# Altium schematic sheet MCU.SchDoc
size A4; SheetNumber: 3; SheetTotal: 5
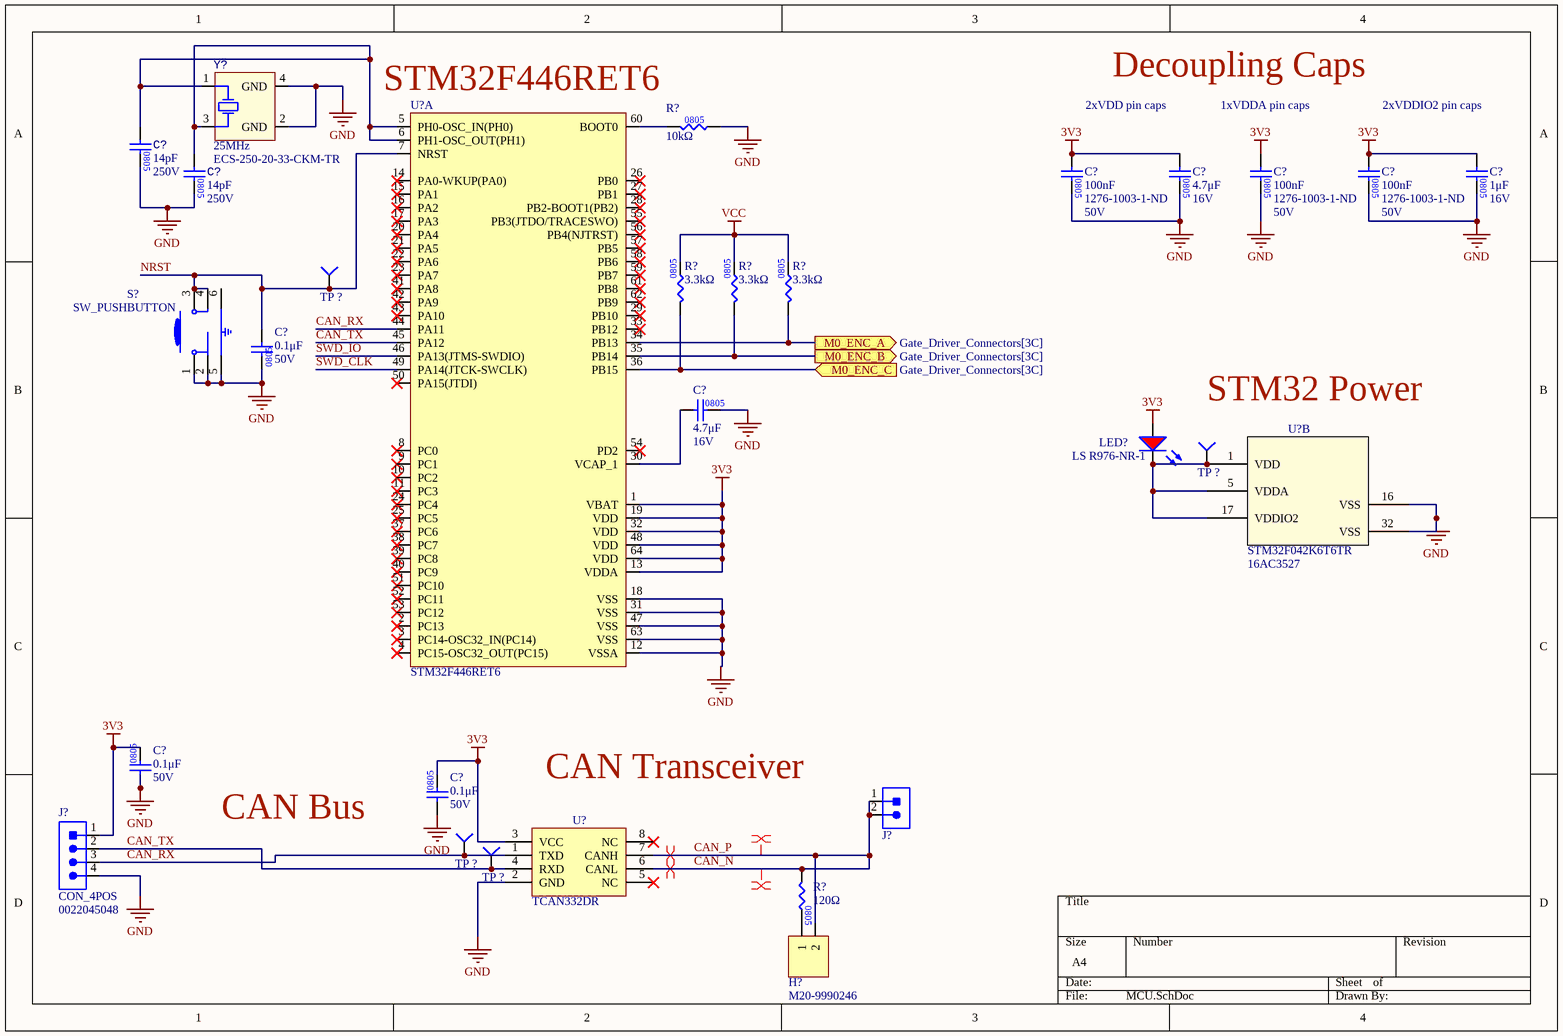
[diagram p0: MCU.SchDoc]

## Parts
(Parts that share a designator on the sheet are numbered #1, #2 ... from top to bottom, then left to right.)
C?#1  value 14pF  Voltage Rating: 250V  [CAP0805]  (hidden comment: CAP_14pF_50V_0805)
C?#2  value 14pF  Voltage Rating: 250V  [CAP0805]  (hidden comment: CAP_14pF_50V_0805)
C?#3  value 100nF  Supplier Part Number 1: 1276-1003-1-ND  Voltage Rating: 50V  [CAP0805]  (hidden comment: CAP_100nF_50V_0805)
C?#4  value 4.7μF  Voltage Rating: 16V  [CAP0805]  (hidden comment: CAP_4.7uF_16V_0805)
C?#5  value 100nF  Supplier Part Number 1: 1276-1003-1-ND  Voltage Rating: 50V  [CAP0805]  (hidden comment: CAP_100nF_50V_0805)
C?#6  value 100nF  Supplier Part Number 1: 1276-1003-1-ND  Voltage Rating: 50V  [CAP0805]  (hidden comment: CAP_100nF_50V_0805)
C?#7  value 1μF  Voltage Rating: 16V  [CAP0805]  (hidden comment: CAP_1uF_16V_0805)
C?#8  value 0.1μF  Voltage Rating: 50V  [CAP2012]  (hidden comment: CAP_0.1uF_50V_0805)
C?#9  value 4.7μF  Voltage Rating: 16V  [CAP0805]  (hidden comment: CAP_4.7uF_16V_0805)
C?#10  value 0.1μF  Voltage Rating: 50V  [CAP0805]  (hidden comment: CAP_0.1uF_50V_0805)
C?#11  value 0.1μF  Voltage Rating: 50V  [CAP0805]  (hidden comment: CAP_0.1uF_50V_0805)
H?  Manufacturer Part Number 1: M20-9990246  [HDR1X2]  (hidden comment: HEADER)
J?#1  CON_2POS_SCREW_TERM  [1935161]  (value not drawn)
J?#2  CON_4POS  Manufacturer Part Number: 0022045048
LED?  Manufacturer Part Number 1: LS R976-NR-1  [LED_0805_RED]  (hidden comment: LED_RED)
R?#1  value 10kΩ  [RES0805]  (hidden comment: RES_10kΩ_0805_5%)
R?#2  value 3.3kΩ  [RES0805]  (hidden comment: RES_3.3kΩ_0805_1%)
R?#3  value 3.3kΩ  [RES0805]  (hidden comment: RES_3.3kΩ_0805_1%)
R?#4  value 3.3kΩ  [RES0805]  (hidden comment: RES_3.3kΩ_0805_1%)
R?#5  value 120Ω  [RES0805]  (hidden comment: RES_120Ω_0805_1%)
S?  SW_PUSHBUTTON  [TACTILE_SWITCH_SMD]
TP_?#1  TESTPOINT_1MM_CIRCLE  [TESTPOINT_CIRCLE_1MM]  (value not drawn)  (no BOM)
TP_?#2  TESTPOINT_1MM_CIRCLE  [TESTPOINT_CIRCLE_1MM]  (value not drawn)  (no BOM)
TP_?#3  TESTPOINT_1MM_CIRCLE  [TESTPOINT_CIRCLE_1MM]  (value not drawn)  (no BOM)
TP_?#4  TESTPOINT_1MM_CIRCLE  [TESTPOINT_CIRCLE_1MM]  (value not drawn)  (no BOM)
U?#1  STM32F446RET6  [STM_LQFP64_N]  (part A of 3)
U?#2  STM32F042K6T6TR  Supplier Part Number 1: 16AC3527  [LQFP-32]  (part B of 2)
U?#3  TCAN332DR  [SOIC127P599X175-8N]
Y?  Frequency: 25MHz  Manufacturer Part Number 1: ECS-250-20-33-CKM-TR  [XTAL_ECS-250-20-33-CKM-TR]  (hidden comment: CRYSTAL_25MHZ_20PF)

## Ports
M0_ENC_A (out, see Gate_Driver_Connectors[3C]), M0_ENC_B (out, see Gate_Driver_Connectors[3C]), M0_ENC_C (in, see Gate_Driver_Connectors[3C])

## Nets
3V3: C?#3.1 C?#4.1 C?#5.1 C?#6.1 C?#7.1 C?#10.2 C?#11.2 J?#2.1 LED?.1(A) U?#1.1(VBAT) U?#1.13(VDDA) U?#1.19(VDD) U?#1.32(VDD) U?#1.48(VDD) U?#1.64(VDD) U?#3.3(VCC)
GND: C?#1.2 C?#2.2 C?#3.2 C?#4.2 C?#5.2 C?#6.2 C?#7.2 C?#8.1 C?#9.2 C?#10.1 C?#11.1 J?#2.4 R?#1.1 S?.1 S?.2 S?.5 U?#1.12(VSSA) U?#1.18(VSS) U?#1.31(VSS) U?#1.47(VSS) U?#1.63(VSS) U?#2.16(VSS) U?#2.32(VSS) U?#3.2(GND) Y?.2(GND) Y?.4(GND)
VCC: R?#2.2 R?#3.2 R?#4.2
CAN_N: H?.2 J?#1.1 J?#1.2 R?#5.1 U?#3.6(CANL) U?#3.7(CANH)  [also labelled CAN_P]
CAN_RX: J?#2.3 TP_?#3.1(=value) U?#1.44(PA11) U?#3.1(TXD)
CAN_TX: J?#2.2 TP_?#4.1(=value) U?#1.45(PA12) U?#3.4(RXD)
M0_ENC_A: R?#4.1 U?#1.34(PB13) ; port M0_ENC_A
M0_ENC_B: R?#3.1 U?#1.35(PB14) ; port M0_ENC_B
M0_ENC_C: R?#2.1 U?#1.36(PB15) ; port M0_ENC_C
NRST: C?#8.2 S?.3 S?.4 TP_?#1.1(=value) U?#1.7(NRST)
SWD_CLK: U?#1.49(PA14(JTCK-SWCLK))
SWD_IO: U?#1.46(PA13(JTMS-SWDIO))
NetC?#1_1: C?#1.1 C?#2.1 U?#1.5(PH0-OSC_IN(PH0)) U?#1.6(PH1-OSC_OUT(PH1)) Y?.1(HOT) Y?.3(HOT)
NetC?#9_1: C?#9.1 U?#1.30(VCAP_1)
NetH?_1: H?.1 R?#5.2
NetLED?_2: LED?.2(K) TP_?#2.1(=value) U?#2.1(VDD) U?#2.5(VDDA) U?#2.17(VDDIO2)
NetR?#1_2: R?#1.2 U?#1.60(BOOT0)

Not connected (* = marked no-connect by the designer): S? 6; U?#1 2(PC13)* 3(PC14-OSC32_IN(PC14))* 4(PC15-OSC32_OUT(PC15))* 8(PC0)* 9(PC1)* 10(PC2)* 11(PC3)* 14(PA0-WKUP(PA0))* 15(PA1)* 16(PA2)* 17(PA3)* 20(PA4)* 21(PA5)* 22(PA6)* 23(PA7)* 24(PC4)* 25(PC5)* 26(PB0)* 27(PB1)* 28(PB2-BOOT1(PB2))* 29(PB10)* 33(PB12)* 37(PC6)* 38(PC7)* 39(PC8)* 40(PC9)* 41(PA8)* 42(PA9)* 43(PA10)* 50(PA15(JTDI))* 51(PC10)* 52(PC11)* 53(PC12)* 54(PD2)* 55(PB3(JTDO/TRACESWO))* 56(PB4(NJTRST))* 57(PB5)* 58(PB6)* 59(PB7)* 61(PB8)* 62(PB9)*; U?#3 5(NC)* 8(NC)*

## Layout directives
differential pair: CAN_N

## Notes on the sheet
- (near U?#1) STM32F446RET6
- 2xVDD pin caps
- Decoupling Caps
- 1xVDDA pin caps
- 2xVDDIO2 pin caps
- STM32 Power
- CAN Transceiver
- CAN Bus

## Library data of the parts
C?#1 C?#2 = CAP_14pF_50V_0805: CERAMIC CAP MLCC HIGH-Q 125C; Manufacturer: Murata Electronics; Manufacturer Part Number: GQM2195C2E140JB12D; Mounting Type: SMD; Package: 0805; Supplier 1: Digi-Key; Supplier Part Number 1: 490-GQM2195C2E140JB12DCT-ND
C?#3 C?#5 C?#6 = CAP_100nF_50V_0805: CAP CER 0.1UF 50V X7R 0805; Manufacturer 1: Samsung Electro-Mechanics; Manufacturer Part Number 1: CL21B104KBCNNNC; Package/Footprint: 0805; Supplier 1: Digi-Key
C?#4 = CAP_4.7uF_16V_0805: CAP CER 4.7UF 16V X5R 0805; Manufacturer 1: Samsung Electro-Mechanics; Manufacturer Part Number 1: CL21A475KOFNNNE; Mounting Type: SMD; Supplier 1: Digi-Key; Supplier Part Number 1: 1276-1065-1-ND; Package: 0805; LCSC Part #: C1779; Dielectric: X5R
C?#7 = CAP_1uF_16V_0805: CAP CER 1UF 16V X7R 0805; Manufacturer 1: Yageo; Manufacturer Part Number 1: CC0805KKX7R7BB105; Mounting Type: SMD; Supplier 1: Digi-Key; Supplier Part Number 1: 311-1365-1-ND; Package: 0805; Dielectric: X7R
C?#8 = CAP_0.1uF_50V_0805: CAP CER 0.1UF 50V X7R 0805; Manufacturer Part Number 1: GCM21BR71H104KA37K; Manufacturer 1: Murata Electronics; Package/Footprint: 0805; Supplier Part Number 1: 490-8049-1-ND; Supplier 1: Digi-Key; Dielectric: X7R; LCSC Part #: C49678; Mounting Type: SMD
C?#9 = CAP_4.7uF_16V_0805: CAP CER 4.7UF 16V X5R 0805; Manufacturer Part Number 1: CL21A475KOFNNNE; Manufacturer 1: Samsung Electro-Mechanics; Supplier Part Number 1: 1276-1065-1-ND; Supplier 1: Digi-Key; Dielectric: X5R; LCSC Part #: C1779; Mounting Type: SMD; Package: 0805
C?#10 C?#11 = CAP_0.1uF_50V_0805: CAP CER 0.1UF 50V X7R 0805; Manufacturer 1: Murata Electronics; Manufacturer Part Number 1: GCM21BR71H104KA37K; Package/Footprint: 0805; Mounting Type: SMD; Supplier 1: Digi-Key; Supplier Part Number 1: 490-8049-1-ND; Dielectric: X7R; LCSC Part #: C49678
H? = HEADER: HEADER 2X1; Manufacturer 1: Harwin Inc.; Package/Footprint: TH; Mounting Type: TH; Supplier 1: Digi-Key; Supplier Part Number 1: 952-2262-ND
J?#1 = CON_2POS_SCREW_TERM: TERM BLK 2POS SIDE ENTRY 5MM; Manufacturer 1: Phoenix Contact; Package/Footprint: SMD; Supplier 1: Digi-Key; Mounting Type: TH; Supplier Part Number 1: 277-1667-ND; Manufacturer Part Number 1: 1935161
J?#2 = CON_4POS: CONN HEADER VERT 4POS 2.54MM; Manufacturer: Molex; Supplier 1: Digi-Key; Supplier Part Number 1: 0022045048-ND; RoHS: Yes; Category: Headers and Wire Housings; Pricing 1: 16000=0.12858 (USD); ComponentLink1URL: https://datasheet.ciiva.com/6839/022045032-sd-6839882.pdf?src-supplier=Digi-Key; ComponentLink1Description: https://datasheet.ciiva.com/6839/022045032-sd-6839882.pdf?src-supplier=Digi-Key
LED? = LED_RED: LED RED DIFFUSED 0805 SMD; Manufacturer 1: OSRAM; Package/Footprint: 0805; Forward Voltage Drop: 2V; Forward Current: 20mA; Supplier Part Number 1: 475-1278-1-ND; Supplier 1: Digi-Key; Mounting Type: SMD
R?#1 = RES_10kΩ_0805_5%: RES 10K OHM 5% 1/8W 0805; Manufacturer 1: Panasonic Electronic Components; Manufacturer Part Number 1: ERJ-6GEYJ103V; Package/Footprint: 0805; Supplier Part Number 1: P10KACT-ND; Supplier 1: Digi-Key; LCSC Part #: C17414; Mounting Type: SMD
R?#2-R?#4 = RES_3.3kΩ_0805_1%: RES 3.3K OHM 1% 1/8W 0805; Manufacturer 1: Vishay Dale; Manufacturer Part Number 1: CRCW06033K30FKEA; Mounting Type: SMD; Supplier 1: Digi-Key; Supplier Part Number 1: 541-3.30KHCT-ND; LCSC Part #: C26010; Package: 0805
R?#5 = RES_120Ω_0805_1%: RES 120 OHM 1% 1/8W 0805; Manufacturer 1: Vishay; Manufacturer Part Number 1: CRCW0805120RFKEA; Package/Footprint: 0805; Supplier 1: Digi-Key; Mounting Type: SMD; Supplier Part Number 1: 541-120CCT-ND; LCSC Part #: C17437
S? = SW_PUSHBUTTON: SMT 3.0 X 2.6 MM TACT SWITCH WIT; Manufacturer 1: Würth Elektronik; Manufacturer Part Number 1: 435151014824; Supplier 1: Digi-Key; Supplier Part Number 1: 732-435151014824CT-ND
TP_?#1-TP_?#4 = TESTPOINT_1MM_CIRCLE: TESTPOINT 1MM CIRCLE
U?#1 = STM32F446RET6: IC MCU 32BIT 512KB FLASH 64LQFP; Manufacturer 1: STMicroelectronics; Manufacturer Part Number 1: LF80CDT-TR; Supplier 1: Digi-Key; Supplier Part Number 1: 497-15376-ND
U?#2 = STM32F042K6T6TR: ARM® Cortex®-M0 STM32F0 Microcontroller IC 32-Bit Single-Core 48MHz 32KB (32K x 8) FLASH 32-LQFP (7x7); Mfr_Name: STMicroelectronics; Voltage - Supply (Vcc/Vdd): 2V ~ 3.6V; Core Processor: ARM® Cortex®-M0; Core Size: 32-Bit Single-Core; Speed: 48MHz; Program Memory Size: 32KB (32K x 8); Operating Temperature: -40°C ~ 85°C (TA); Package / Case: 32-LQFP; ComponentLink1Description: digikey; ComponentLink1URL: https://www.digikey.com/en/products/detail/stmicroelectronics/STM32F042K6T6TR/10414582; Supplier 1: Avnet
U?#3 = TCAN332DR: IC CAN TRANSCEIVER; Manufacturer 1: Texas Instruments; Manufacturer Part Number 1: TCAN332DR; Supplier 1: Digi-Key; Supplier Part Number 1: 296-43711-1-ND
Y? = CRYSTAL_25MHZ_20PF: CRYSTAL 25.0000MHZ 20PF SMD; Manufacturer 1: ECS Inc.; Load Capacitance: 20pF; Supplier 1: Digi-Key; Supplier Part Number 1: XC1817CT-ND; Mounting Type: SMD; Package/Footprint: SMD